# EasyEDA Pro project TTMT_ENTIRE_EASYEDA_PROJECT.epro, schematic GeigerBoardSchematic
Board Name: 4 GeigerBoard; Create Date: 2026-05-12; Page Name: P1; Project Name: To The Moon Together - An Amateur Sounding Rocket; Schematic Name: GeigerBoardSchematic; Update Date: 2026-05-13; Company: EasyEDA.com; Page Size: A4; Version: V1.0
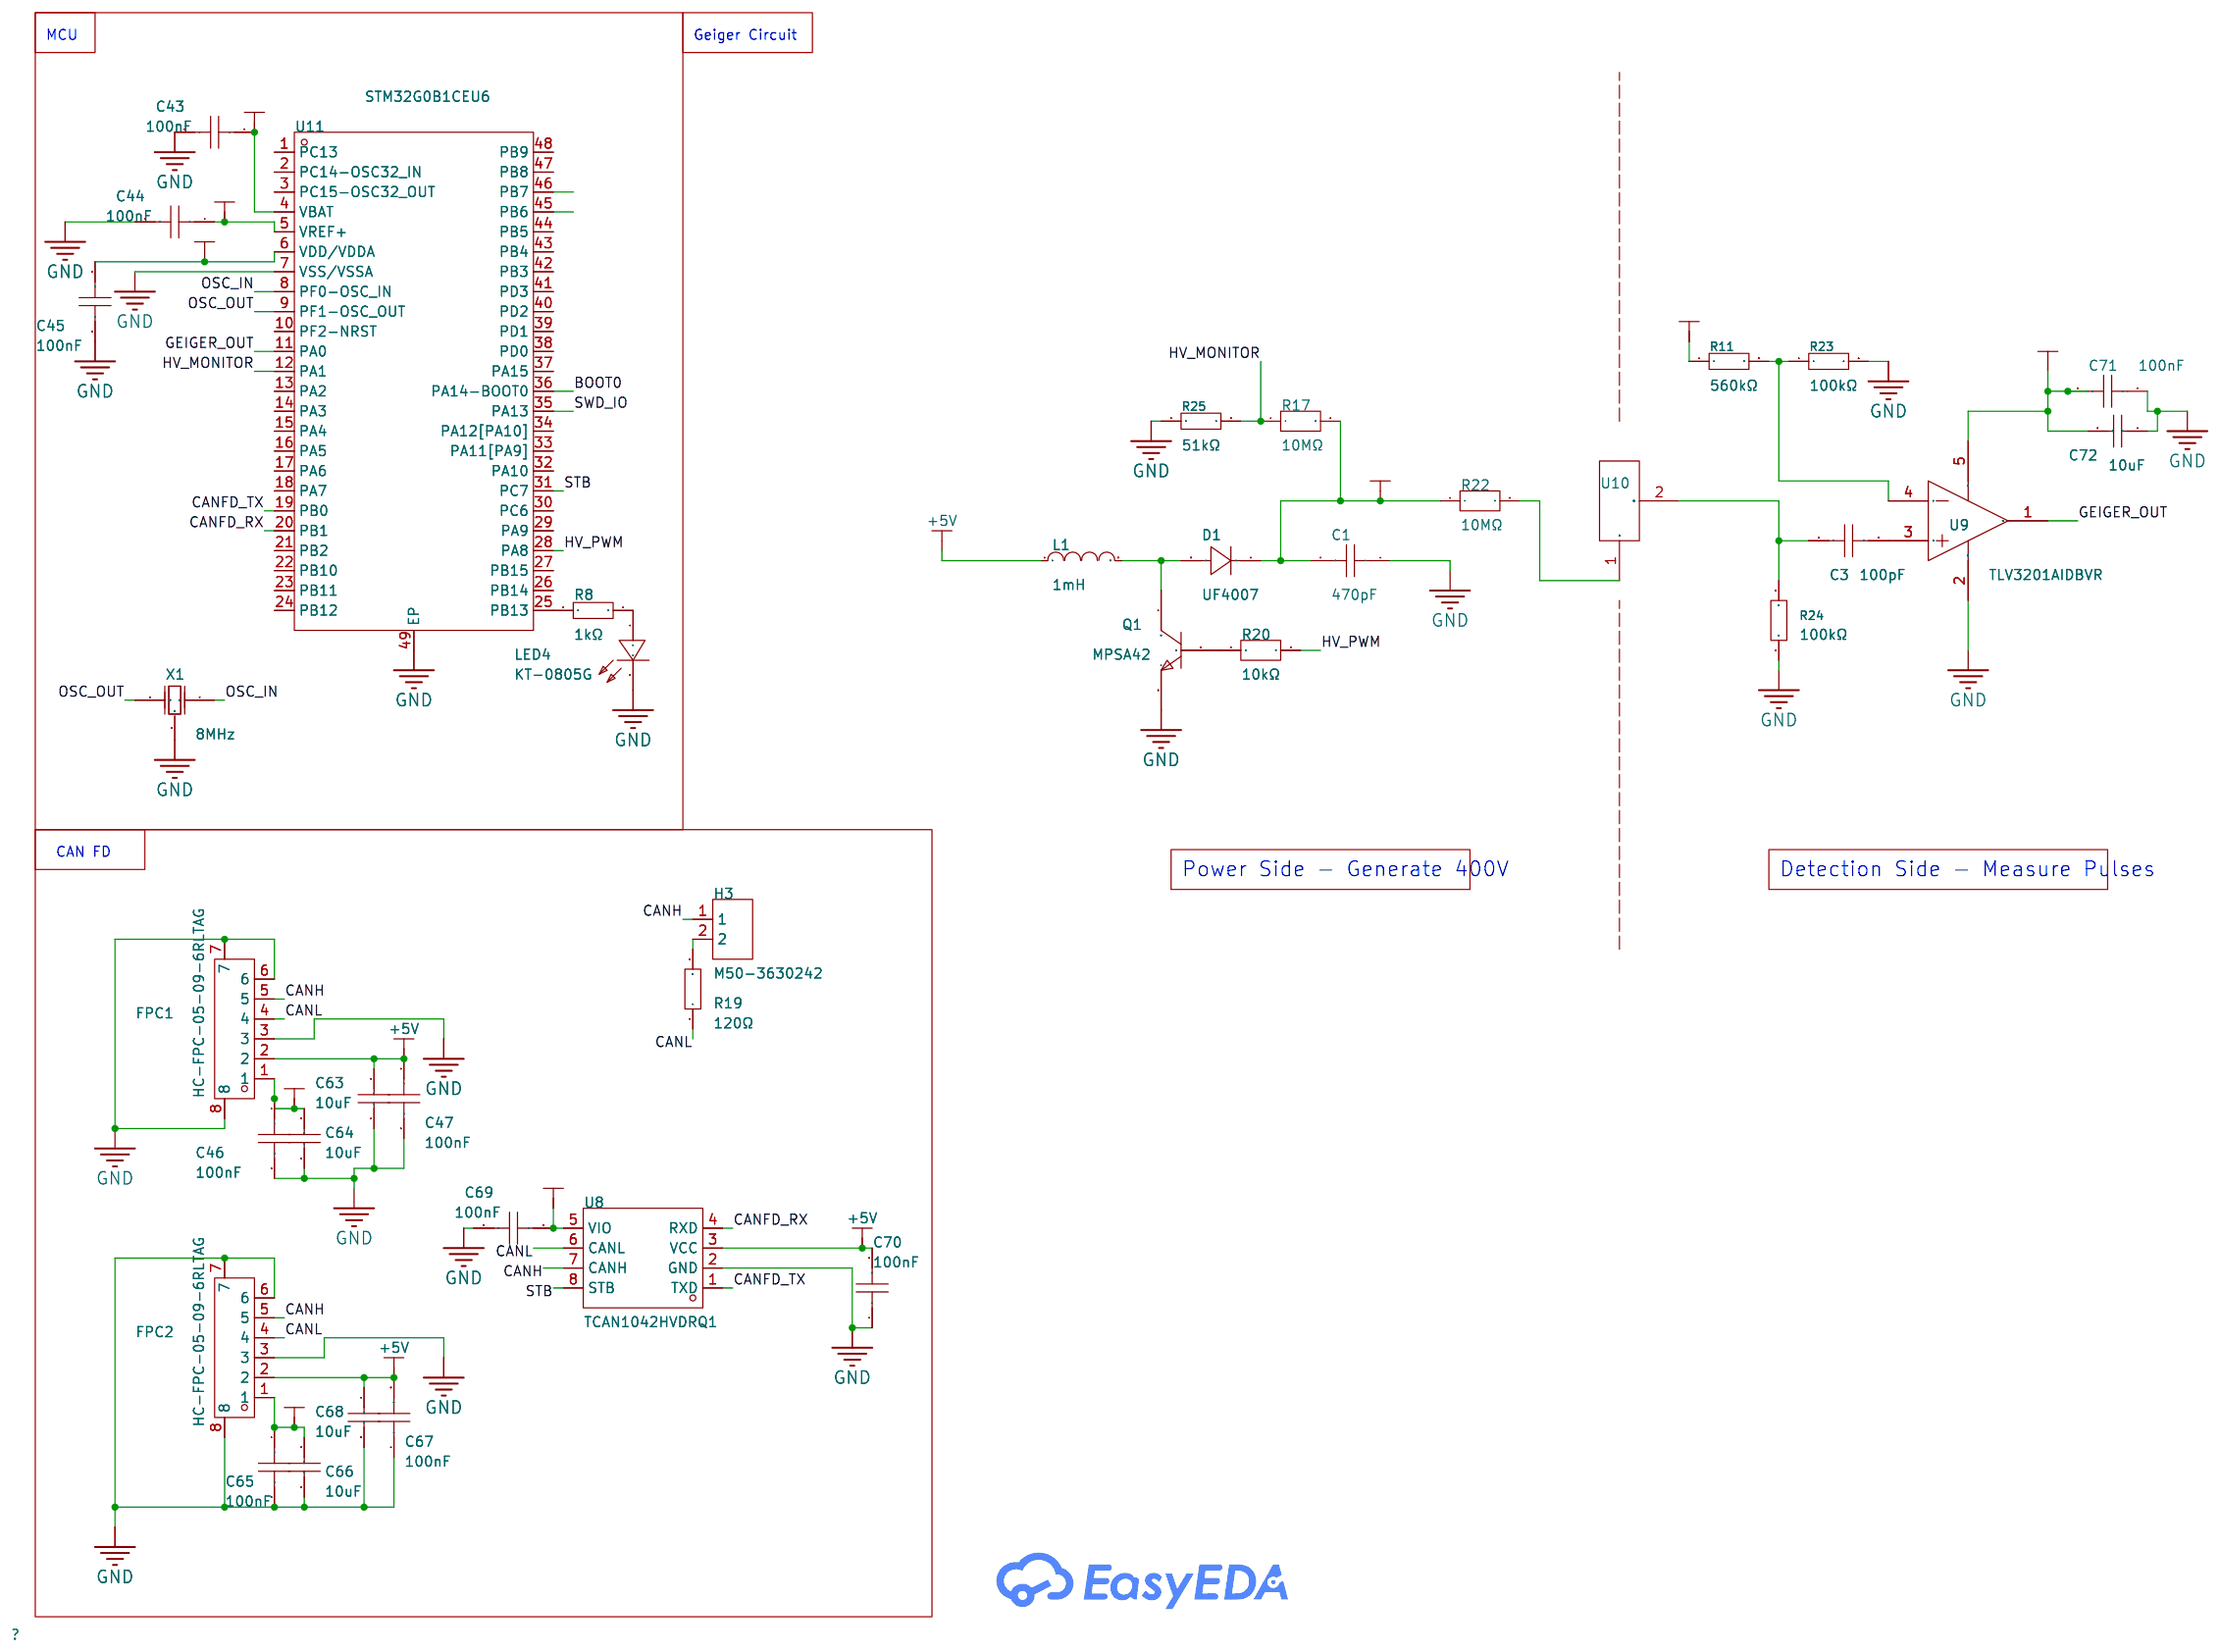
[diagram p4: schematic sheet]

## Parts
C1  470pF  [C1111]
C3  100pF  [C1206]
C43  100nF  [C0402]
C44  100nF  [C0402]
C45  100nF  [C0402]
C46  100nF  [C0402]
C47  100nF  [C0402]
C63  10uF  [C0402]
C64  10uF  [C0402]
C65  100nF  [C0402]
C66  10uF  [C0402]
C67  100nF  [C0402]
C68  10uF  [C0402]
C69  100nF  [C0402]
C70  100nF  [C0402]
C71  100nF  [C0402]
C72  10uF  [C0402]
D1  UF4007  [DO-41_BD2.4-L4.7-P8.70-D0.9-RD]
FPC1  HC-FPC-05-09-6RLTAG  [FPC-SMD_6P-P0.50_HC-FPC-05-09-6RLTAG]
FPC2  HC-FPC-05-09-6RLTAG  [FPC-SMD_6P-P0.50_HC-FPC-05-09-6RLTAG]
H3  M50-3630242  [HDR-SMD_2P-P1.27_M50-3630242]
L1  1mH  [IND-SMD_L5.0-W5.0_FNR50XXS]
LED4  KT-0805G  [LED0805-R-RD]
Q1  MPSA42  [TO-92-3_L4.8-W3.7-P2.54-R]
R8  1kΩ  [R0402]
R11  560kΩ  [R0402]
R17  10MΩ  [R1206]
R19  120Ω  [R0402]
R20  10kΩ  [R0402]
R22  10MΩ  [R1206]
R23  100kΩ  [R0402]
R24  100kΩ  [R0402]
R25  51kΩ  [R0805]
U8  TCAN1042HVDRQ1  [SOIC-8_L4.9-W3.9-P1.27-LS6.0-BL]
U9  TLV3201AIDBVR  [SOT-23-5_L3.0-W1.7-P0.95-LS2.8-BR]
U10  SBM-21  [SBM21]  (no BOM)
U11  STM32G0B1CEU6  [UFQFPN-48_L7.0-W7.0-P0.50-BL-EP]
X1  8MHz  [OSC-SMD_3P-L3.2-W1.3-P1.20-L]

## Library data of the parts
C1 = VJ1111D471KXLAT: Capacitance:470pF Tolerance:±10% Tolerance:±10% Voltage Rating:630V Temperature Coefficient:C0G; LCSC Part Name: 470pF ±10% 630V; Supplier Part: C2314698; Manufacturer: VISHAY(威世); Supplier Footprint: 1111; JLCPCB Part Class: Extended Part; Datasheet: https://item.szlcsc.com/datasheet/VJ1111D471KXLAT/2406794.html; Supplier: LCSC; Tolerance: ±10%; Voltage Rating: 630V; Temperature Coefficient: C0G
C3 = 1206N101J631CT: Capacitance: Tolerance:±5% Tolerance:±5% Voltage Rated: Temperature Coefficient:; LCSC Part Name: 100pF ±5% 630V; Supplier Part: C3866841; Manufacturer: Walsin(华新科); Supplier Footprint: 1206; JLCPCB Part Class: Extended Part; Datasheet: https://atta.szlcsc.com/upload/public/pdf/source/20230922/C914574D0A74BEF9995333FF99F7B45C.pdf; Supplier: LCSC; Tolerance: ±5%
C43-C47 C65 C67 C69-C71 = CL05B104KO5NNNC: Capacitance:100nF Tolerance:±10% Tolerance:±10% Voltage Rating:16V Temperature Coefficient:X7R; LCSC Part Name: 100nF ±10% 16V; Supplier Part: C1525; Manufacturer: SAMSUNG(三星); Supplier Footprint: 0402; JLCPCB Part Class: Basic Part; Datasheet: https://item.szlcsc.com/datasheet/CL05B104KO5NNNC/1877.html; Supplier: LCSC; Tolerance: ±10%; Voltage Rating: 16V; Temperature Coefficient: X7R
C63 C64 C66 C68 C72 = CL05A106MQ5NUNC: Capacitance:10uF Tolerance:±20% Tolerance:±20% Voltage Rating:6.3V Temperature Coefficient:X5R; LCSC Part Name: 10uF ±20% 6.3V; Supplier Part: C15525; Manufacturer: SAMSUNG(三星); Supplier Footprint: 0402; JLCPCB Part Class: Basic Part; Datasheet: https://item.szlcsc.com/datasheet/CL05A106MQ5NUNC/16204.html; Supplier: LCSC; Tolerance: ±20%; Voltage Rating: 6.3V; Temperature Coefficient: X5R
D1 = UF4007_C960666: Diode Configuration:- Voltage - Forward(Vf@If):1.7V@1A Voltage - DC Reverse(Vr):1kV Current - Rectified:1A Reverse Leakage Current (Ir):5uA@1kV Reverse Recovery Time (trr):75ns Operating Junction Temperature Range:-50℃~+150℃ Operating Junction Temperature; LCSC Part Name: 耐压:1kV 电流:1A 反向恢复时间：75ns; Supplier Part: C960666; Manufacturer: MDD(辰达半导体); Supplier Footprint: DO-41; JLCPCB Part Class: Extended Part; Datasheet: https://item.szlcsc.com/datasheet/UF4007/1039942.html; Supplier: LCSC; Voltage - Forward(Vf@If): 1.7V@1A; Voltage - DC Reverse(Vr): 1kV; Current - Rectified: 1A; Reverse Leakage Current (Ir): 5uA@1kV; Reverse Recovery Time (trr): 75ns; Operating Junction Temperature Range: -50℃~+150℃; Non-Repetitive Peak Forward Surge Current: 30A
FPC1 FPC2 = HC-FPC-05-09-6RLTAG: Locking Feature:Hinged Lid Contact Type:Double-Sided Contacts, Top and Bottom Entry Number of Contacts:6P Pitch:0.5mm Mounting Type:Surface Mount, Right Angle FFC, FCB Thickness:0.3mm FFC, FCB Thickness:0.3mm Height Above Board:1mm Contact Material:Copper; LCSC Part Name: 翻盖式 双侧触点/上下接 P数:6P 间距:0.5mm; Supplier Part: C5213748; Manufacturer: HCTL(华灿天禄); Supplier Footprint: SMD,P=0.5mm,卧贴; JLCPCB Part Class: Extended Part; Datasheet: https://item.szlcsc.com/datasheet/HC-FPC-05-09-6RLTAG/5909040.html; Supplier: LCSC; Locking Feature: Hinged Lid; Contact Type: Double-Sided Contacts, Top and Bottom Entry; Number of Contacts: 6P; Pitch: 0.5mm; Mounting Type: Surface Mount, Right Angle; FFC, FCB Thickness: 0.3mm; Height Above Board: 1mm; Contact Material: Copper Alloy; Operating Temperature: -55℃~+85℃
H3 = M50-3630242: Pitch:1.27mm Row Spacing:- Circluar Pins/Square Pins:Pin Header Mounting Type:Surface Mount,Vertical Number of Rows:1 Number of Pins:2P Current Rating:1A Length of Mating Pin:3mm Insulation Height:1mm Length of End Connection Pin:- Contact Material:Brass; LCSC Part Name: 间距:1.27mm 方针 立贴; Supplier Part: C7297891; Manufacturer: Harwin; Supplier Footprint: SMD,P=1.27mm; JLCPCB Part Class: Extended Part; Datasheet: https://item.szlcsc.com/datasheet/M50-3630242/8267898.html; Supplier: LCSC; Pitch: 1.27mm; Circluar Pins/Square Pins: Pin Header; Mounting Type: Surface Mount,Vertical; Number of Rows: 1; Number of Pins: 2P; Current Rating: 1A; Length of Mating Pin: 3mm; Insulation Height: 1mm; Contact Material: Brass; Contact Plating: Tin; Operating Temperature: -40℃~+105℃; Color: Black
L1 = FNR5040S102MT: Inductance:1000uH Tolerance:±20% Tolerance:±20% Current Rating:230mA Current - Saturation(Isat):250mA DC Resistance(DCR):7.8Ω Type:Magnetic Core Shielded Winding Alloy Inductor; LCSC Part Name: 1mH ±20% 250mA; Supplier Part: C167987; Manufacturer: cjiang(长江微电); Supplier Footprint: SMD,5x5mm; JLCPCB Part Class: Extended Part; Datasheet: https://atta.szlcsc.com/upload/public/pdf/source/20190327/C167925_9EFF0AABC4CA629C2CC95961DBF7D39D.pdf; Supplier: LCSC; Tolerance: ±20%; Current Rating: 230mA; Current - Saturation(Isat): 250mA; DC Resistance(DCR): 7.8Ω; Type: Magnetic Core Shielded Winding Alloy Inductor
LED4 = KT-0805G: Lamp Holder Type:- Illumination Color:Emerald Green Voltage - Forward(Vf):2.6V~3.1V Voltage - Forward(Vf):2.6V~3.1V Power(Watts):100mW Forward Current:5mA Wavelength - Dominant:513nm~528nm Wavelength - Dominant:513nm~528nm Peak Wavelength:525nm Diode Conf; LCSC Part Name: 0805 翠绿 高亮; Supplier Part: C2297; Manufacturer: KENTO; Supplier Footprint: 0805; JLCPCB Part Class: Basic Part; Datasheet: https://item.szlcsc.com/datasheet/KT-0805G/2670.html; Supplier: LCSC; Illumination Color: Emerald Green; Voltage - Forward(Vf): 2.6V~3.1V; Power(Watts): 100mW; Forward Current: 5mA; Wavelength - Dominant: 513nm~528nm; Peak Wavelength: 525nm; Diode Configuration: Discrete Diode; Lens Color: Water Clear; Luminous Intensity: 430mcd; Viewing Angle: 120°; Operating Temperature: -40℃~+85℃
Q1 = MPSA42_C305411: type:NPN Current - Collector(Ic):500mA Collector - Emitter Voltage VCEO:300V Pd - Power Dissipation:1.5W DC Current Gain:40@10mA,10V DC Current Gain:40@10mA,10V Transition frequency(fT):50MHz Current - Collector Cutoff:100nA Vce Saturation(VCE(sat)):500mV; LCSC Part Name: TO-92塑封封装NPN半导体三极管; Supplier Part: C305411; Manufacturer: BLUE ROCKET(蓝箭); Supplier Footprint: TO-92; JLCPCB Part Class: Extended Part; Datasheet: https://item.szlcsc.com/datasheet/MPSA42/289740.html; Supplier: LCSC; type: NPN; Current - Collector(Ic): 500mA; Collector - Emitter Voltage VCEO: 300V; Pd - Power Dissipation: 1.5W; DC Current Gain: 40@10mA,10V; Transition frequency(fT): 50MHz; Current - Collector Cutoff: 100nA; Vce Saturation(VCE(sat)): 500mV@20mA,2.0mA; Emitter-Base Voltage(Vebo): 6V; Number: 1 NPN
R8 = 0402WGF1001TCE: Type:Thick Film Resistor Resistance:1kΩ Tolerance:±1% Tolerance:±1% Power(Watts):62.5mW Voltage-Supply(Max):50V Temperature Coefficient:±100ppm/℃ Temperature Coefficient:±100ppm/℃ Operating Temperature:-55℃~+155℃ Operating Temperature:-55℃~+155℃; LCSC Part Name: 1kΩ ±1% 62.5mW 厚膜电阻; Supplier Part: C11702; Manufacturer: UNI-ROYAL(厚声); Supplier Footprint: 0402; JLCPCB Part Class: Basic Part; Datasheet: https://item.szlcsc.com/datasheet/0402WGF1001TCE/12256.html; Supplier: LCSC; Type: Thick Film Resistor; Tolerance: ±1%; Power(Watts): 62.5mW; Voltage-Supply(Max): 50V; Temperature Coefficient: ±100ppm/℃; Operating Temperature: -55℃~+155℃
R11 = 0402WGF5603TCE: Type:Thick Film Resistor Resistance:560kΩ Tolerance:±1% Tolerance:±1% Power(Watts):62.5mW Voltage-Supply(Max):50V Temperature Coefficient:±100ppm/℃ Temperature Coefficient:±100ppm/℃ Operating Temperature:-55℃~+155℃ Operating Temperature:-55℃~+155℃; LCSC Part Name: 560kΩ ±1% 62.5mW 厚膜电阻; Supplier Part: C132339; Manufacturer: UNI-ROYAL(厚声); Supplier Footprint: 0402; JLCPCB Part Class: Extended Part; Datasheet: https://item.szlcsc.com/datasheet/0402WGF5603TCE/143638.html; Supplier: LCSC; Type: Thick Film Resistor; Tolerance: ±1%; Power(Watts): 62.5mW; Voltage-Supply(Max): 50V; Temperature Coefficient: ±100ppm/℃; Operating Temperature: -55℃~+155℃
R17 R22 = KTR18EZPJ106: Type:Thick Film Resistor Resistance:10MΩ Tolerance:±5% Tolerance:±5% Power(Watts):250mW Voltage-Supply(Max):500V Temperature Coefficient:±200ppm/℃ Temperature Coefficient:±200ppm/℃ Operating Temperature:-55℃~+155℃ Operating Temperature:-55℃~+155℃; LCSC Part Name: 厚膜电阻 10MΩ ±5% 250mW; Supplier Part: C2092802; Manufacturer: ROHM(罗姆); Supplier Footprint: 1206; JLCPCB Part Class: Extended Part; Datasheet: https://item.szlcsc.com/datasheet/KTR18EZPJ106/2184393.html; Supplier: LCSC; Type: Thick Film Resistor; Tolerance: ±5%; Power(Watts): 250mW; Voltage-Supply(Max): 500V; Temperature Coefficient: ±200ppm/℃; Operating Temperature: -55℃~+155℃
R19 = 0402WGF1200TCE: Type:Thick Film Resistor Resistance:120Ω Tolerance:±1% Tolerance:±1% Power(Watts):62.5mW Voltage-Supply(Max):50V Temperature Coefficient:±100ppm/℃ Temperature Coefficient:±100ppm/℃ Operating Temperature:-55℃~+155℃ Operating Temperature:-55℃~+155℃; LCSC Part Name: 120Ω ±1% 62.5mW 厚膜电阻; Supplier Part: C25079; Manufacturer: UNI-ROYAL(厚声); Supplier Footprint: 0402; JLCPCB Part Class: Basic Part; Datasheet: https://item.szlcsc.com/datasheet/0402WGF1200TCE/25822.html; Supplier: LCSC; Type: Thick Film Resistor; Tolerance: ±1%; Power(Watts): 62.5mW; Voltage-Supply(Max): 50V; Temperature Coefficient: ±100ppm/℃; Operating Temperature: -55℃~+155℃
R20 = FRC0402J103 TS: Type:Thick Film Resistor Resistance:10kΩ Tolerance:±5% Tolerance:±5% Power(Watts):62.5mW Voltage-Supply(Max):50V Temperature Coefficient:±100ppm/℃ Temperature Coefficient:±100ppm/℃ Operating Temperature:-55℃~+155℃ Operating Temperature:-55℃~+155℃; LCSC Part Name: 10kΩ ±5% 62.5mW 厚膜电阻; Supplier Part: C2906885; Manufacturer: FOJAN(富捷); Supplier Footprint: 0402; JLCPCB Part Class: Extended Part; Supplier: LCSC; Type: Thick Film Resistor; Tolerance: ±5%; Power(Watts): 62.5mW; Voltage-Supply(Max): 50V; Temperature Coefficient: ±100ppm/℃; Operating Temperature: -55℃~+155℃
R23 R24 = 0402WGF1003TCE: Type:Thick Film Resistor Resistance:100kΩ Tolerance:±1% Tolerance:±1% Power(Watts):62.5mW Voltage-Supply(Max):50V Temperature Coefficient:±100ppm/℃ Temperature Coefficient:±100ppm/℃ Operating Temperature:-55℃~+155℃ Operating Temperature:-55℃~+155℃; LCSC Part Name: 100kΩ ±1% 62.5mW 厚膜电阻; Supplier Part: C25741; Manufacturer: UNI-ROYAL(厚声); Supplier Footprint: 0402; JLCPCB Part Class: Basic Part; Datasheet: https://item.szlcsc.com/datasheet/0402WGF1003TCE/26484.html; Supplier: LCSC; Type: Thick Film Resistor; Tolerance: ±1%; Power(Watts): 62.5mW; Voltage-Supply(Max): 50V; Temperature Coefficient: ±100ppm/℃; Operating Temperature: -55℃~+155℃
R25 = 0805W8F5102T5E: Type:Thick Film Resistor Resistance:51kΩ Tolerance:±1% Tolerance:±1% Power(Watts):125mW Voltage-Supply(Max):150V Temperature Coefficient:±100ppm/℃ Temperature Coefficient:±100ppm/℃ Operating Temperature:-55℃~+155℃ Operating Temperature:-55℃~+155℃; LCSC Part Name: 51kΩ ±1% 125mW 厚膜电阻; Supplier Part: C17737; Manufacturer: UNI-ROYAL(厚声); Supplier Footprint: 0805; JLCPCB Part Class: Basic Part; Datasheet: https://item.szlcsc.com/datasheet/0805W8F5102T5E/18425.html; Supplier: LCSC; Type: Thick Film Resistor; Tolerance: ±1%; Power(Watts): 125mW; Voltage-Supply(Max): 150V; Temperature Coefficient: ±100ppm/℃; Operating Temperature: -55℃~+155℃
U8 = TCAN1042HVDRQ1: Type:CAN FD Transceiver Data Rate:2Mbps Voltage - Supply:4.5V~5.5V Voltage - Supply:4.5V~5.5V Current - Supply:80mA Operating Temperature:-55℃~+125℃ Operating Temperature:-55℃~+125℃ Number of Channels:- Quiescent Supply Current:22uA; LCSC Part Name: TCAN1042-Q1 汽车故障保护 CAN 收发器，带 CAN FD; Supplier Part: C485807; Manufacturer: TI(德州仪器); Supplier Footprint: SOIC-8; JLCPCB Part Class: Extended Part; Datasheet: https://www.ti.com/cn/lit/gpn/tcan1042hv-q1; Supplier: LCSC; Type: CAN FD Transceiver; Data Rate: 2Mbps; Voltage - Supply: 4.5V~5.5V; Current - Supply: 80mA; Operating Temperature: -55℃~+125℃; Quiescent Supply Current: 22uA
U9 = TLV3201AIDBVR: Number of Channels:1 Vos - Input Offset Voltage:1mV Ib - Input Bias Current:1pA Propagation Delay Time:40ns Input Hysteresis Voltage (Vhys):1mV Common Mode Rejection Ratio(CMRR):- Output Type:- Output Type:CMOS Rail to Rail:Rail-to-Rail Input Quiescent Cu; LCSC Part Name: 40纳秒低功耗推挽输出比较器; Supplier Part: C105188; Manufacturer: TI(德州仪器); Supplier Footprint: SOT-23-5; JLCPCB Part Class: Extended Part; Datasheet: https://www.ti.com/cn/lit/gpn/tlv3201; Supplier: LCSC; Number of Channels: 1; Vos - Input Offset Voltage: 1mV; Ib - Input Bias Current: 1pA; Propagation Delay Time: 40ns; Input Hysteresis Voltage (Vhys): 1mV; Output Type: CMOS; Rail to Rail: Rail-to-Rail Input; Quiescent Current: 40uA; Operating Temperature: -40℃~+125℃
U10 = SBM21
U11 = STM32G0B1CEU6: LCSC Part Name: 主流Arm Cortex-M0+ 32位MCU，最高512KB闪存，144KB内存，6个USART，定时器，ADC，DAC，通信接口，1.7-3.6V; Supplier Part: C2829190; Manufacturer: ST(意法半导体); Supplier Footprint: UFQFPN-48(7x7); JLCPCB Part Class: Extended Part; Datasheet: https://item.szlcsc.com/datasheet/STM32G0B1CEU6/2979251.html; Supplier: LCSC
X1 = CSTNE8M00GH5C000R0: Frequency:8MHz Built - in Load Capacitance:33pF Resonant Impedance:40Ω Operating Temperature:-40℃~+125℃ Operating Temperature:-40℃~+125℃; LCSC Part Name: 8MHz ±0.07% 内置负载电容:33pF; Supplier Part: C341525; Manufacturer: muRata(村田); Supplier Footprint: SMD3213-3P; JLCPCB Part Class: Extended Part; Datasheet: https://item.szlcsc.com/datasheet/CSTNE8M00GH5C000R0/318917.html; Supplier: LCSC; Built - in Load Capacitance: 33pF; Resonant Impedance: 40Ω; Operating Temperature: -40℃~+125℃

## Nets
3V3: C43.1 C44.1 C45.1 C46.1 C64.2 C65.1 C66.2 C69.1 C71.2 C72.2 FPC1.1 FPC2.1 R11.1 U8.5(VIO) U9.5(VCC) U11.4(VBAT) U11.5(VREF+) U11.6(VDD/VDDA)
+5V: C47.1 C63.2 C67.2 C68.1 C70.2 FPC1.2 FPC2.2 L1.1 U8.3(VCC)
+400V: C1.2 D1.1(K) R17.2 R22.1
GND: C1.1 C43.2 C44.2 C45.2 C46.2 C47.2 C63.1 C64.1 C65.2 C66.1 C67.1 C68.2 C69.2 C70.1 C71.1 C72.1 FPC1.3 FPC1.6 FPC1.7 FPC1.8 FPC2.3 FPC2.6 FPC2.7 FPC2.8 LED4.2(K) Q1.3(E) R23.2 R24.1 R25.1 U8.2(GND) U9.2(GND) U11.7(VSS/VSSA) U11.49(EP) X1.2(GND)
BOOT0: U11.36(PA14-BOOT0)
CANFD_RX: U8.4(RXD) U11.20(PB1)
CANFD_TX: U8.1(TXD) U11.19(PB0)
CANH: FPC1.5 FPC2.5 H3.1 U8.7(CANH)
CANL: FPC1.4 FPC2.4 R19.1 U8.6(CANL)
GEIGER_OUT: U9.1(OUT) U11.11(PA0)
HV_MONITOR: R17.1 R25.2 U11.12(PA1)
HV_PWM: R20.2 U11.28(PA8)
OSC_IN: U11.8(PF0-OSC_IN) X1.1(OSC1)
OSC_OUT: U11.9(PF1-OSC_OUT) X1.3(OSC2)
STB: U8.8(STB) U11.31(PC7)
SWD_IO: U11.35(PA13)
$1N2732: H3.2 R19.2
$1N2784: D1.2(A) L1.2 Q1.1(C)
$1N3117: C3.2 U9.3(IN+)
$1N3842: Q1.2(B) R20.1
$1N4040: R11.2 R23.1 U9.4(IN-)
$1N4044: C3.1 R24.2 U10.2(Cathode)
$1N4167: R22.2 U10.1(Anode)
$1N9534: LED4.1(A) R8.1
$1N11861: R8.2 U11.25(PB13)

Not connected (* = marked no-connect by the designer): U11 1(PC13) 2(PC14-OSC32_IN) 3(PC15-OSC32_OUT) 10(PF2-NRST) 13(PA2) 14(PA3) 15(PA4) 16(PA5) 17(PA6) 18(PA7) 21(PB2) 22(PB10) 23(PB11) 24(PB12) 26(PB14) 27(PB15) 29(PA9) 30(PC6) 32(PA10) 33(PA11[PA9]) 34(PA12[PA10]) 37(PA15) 38(PD0) 39(PD1) 40(PD2) 41(PD3) 42(PB3) 43(PB4) 44(PB5) 45(PB6) 46(PB7) 47(PB8) 48(PB9)

## Notes on the sheet
- MCU
- Geiger Circuit
- CAN FD
- Power Side - Generate 400V
- Detection Side - Measure Pulses
